# EAGLE design *StepperDriver (EAGLE 7.2.0)
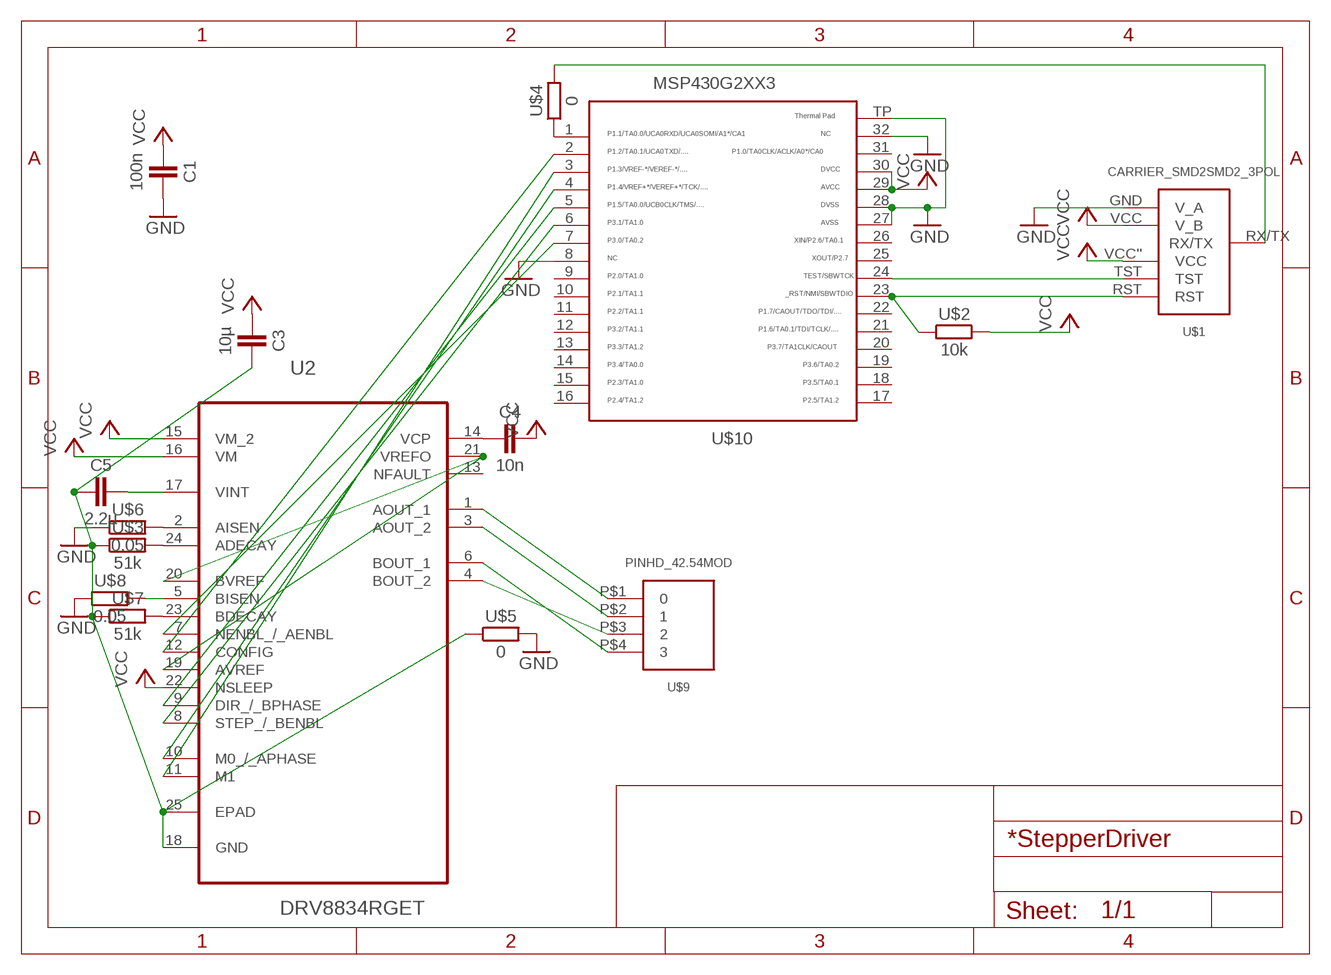
[diagram p0: schematic, sheet 1]

## Parts
C1  100n  CAPACITOR  [603]
C3  10µ  CAPACITOR  [603]
C4  10n  CAPACITOR  [603]
C5  2.2µ  CAPACITOR  [603]
U2  DRV8834RGET  [QFN50P400X400X100-25N]
U$1  CARRIER_SMD2SMD2_3POL  [CARRIER_SMD2_3POL]
U$2  10k  RESISTOR0603  [603]
U$3  51k  RESISTOR0603  [603]
U$4  0  RESISTOR0603  [603]
U$5  0  RESISTOR0603  [603]
U$6  0.05  RESISTOR0603  [603]
U$7  51k  RESISTOR0603  [603]
U$8  0.05  RESISTOR0603  [603]
U$9  PINHD_42.54MOD  [PINHD_4_MOD]
U$10  MSP430G2553  [QFN32]

## Nets
GND: C1.2 U$1.GND(V_A) U$5.2 U$6.1 U$8.1 U$10.8 U$10.27 U$10.28 U$10.32 U$10.TP
N$2: C5.2 U2.17(VINT)
N$3: U$1.TST U$10.24
N$4: U$1.RST U$2.1 U$10.23
N$5: C4.1 U2.14(VCP)
N$6: U2.24(ADECAY) U$3.2
N$7: U2.23(BDECAY) U$7.2
N$11: U$4.1 U$10.1
N$12: U$1.RX/TX U$4.2
N$13: U2.2(AISEN) U$6.2
N$14: U2.5(BISEN) U$8.2
N$16: U2.6(BOUT_1) U$9.P$4
N$18: U2.4(BOUT_2) U$9.P$3
N$21: C3.2 C5.1 U2.18(GND) U2.25(EPAD) U$3.1 U$5.1 U$7.1
N$23: U2.1(AOUT_1) U$9.P$1
N$24: U2.3(AOUT_2) U$9.P$2
N$27: U2.19(AVREF) U2.20(BVREF) U2.21(VREFO)
N$29: U2.10(M0_/_APHASE) U$10.4
N$32: U2.11(M1) U$10.3
N$34: U2.7(NENBL_/_AENBL) U$10.7
N$35: U2.8(STEP_/_BENBL) U$10.6
N$36: U2.12(CONFIG) U$10.2
N$37: U2.9(DIR_/_BPHASE) U$10.5
VCC: C1.1 C3.1 C4.2 U2.15(VM_2) U2.16(VM) U2.22(NSLEEP) U$1.VCC''(VCC) U$1.VCC(V_B) U$2.2 U$10.29 U$10.30
Unconnected: U2.13(NFAULT) U$10.9 U$10.10 U$10.11 U$10.12 U$10.13 U$10.14 U$10.15 U$10.16 U$10.17 U$10.18 U$10.19 U$10.20 U$10.21 U$10.22 U$10.25 U$10.26 U$10.31

## Library data of the parts
C1 C3-C5 = thar:CAPACITOR
U2 = DRV8834_QFN:DRV8834RGET: DUAL BRIDGE STEPPER OR DC MOTOR DRIVER,QFN-24; MPN: DRV8834RGET; OC_FARNELL: 2144264; OC_NEWARK: 27W5089; PACKAGE: QFN-24; SUPPLIER: TEXAS INSTRUMENTS
U$1 = thar:CARRIER_SMD2
U$2-U$8 = thar:RESISTOR
U$9 = thar:PINHD_4
U$10 = thar:MSP430G2553: TEXAS INSTRUMENTS MSP430G2553IRHB32R MCU, 16BIT, MSP430, 16MHZ, QFN-32 Farnell Best.Nr.: 2325726 Herst.Bez.: MSP430G2553IRHB32R

## Board
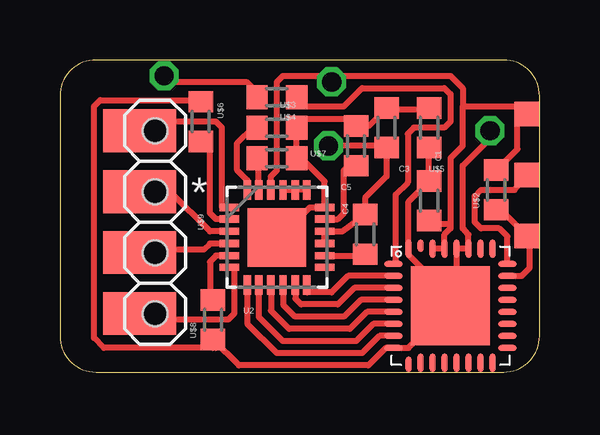
[diagram p1: board, top side]
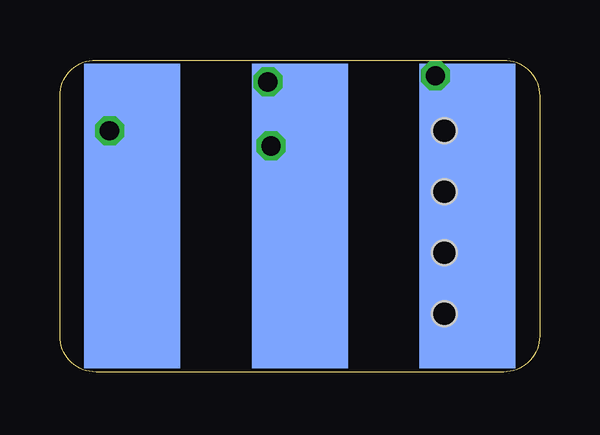
[diagram p2: board, bottom side, seen from below]

Size 20 x 13 mm. Coordinates in mm from the lower left corner, seen from the top.
Copper layers (1*16): Top 0.035mm / dielectric 1.5mm / Bottom 0.035mm
Design rules "Bilex DRU *": minimum track width 10mil, minimum drill 24mil, track to track 10mil, track to pad 10mil, pad to pad 10mil, via to via 10mil, smd to smd 10mil, copper to edge 1mil, drill to drill 8mil, minimum pad ring 10mil, minimum via ring 8mil, stop-mask expansion 4mil, vias tented up to drill 0mil, thermal gap 10mil

### Footprints (pad centres in the part's own frame; a part is rotated, then mirrored left to right if it is on the bottom)
603 = smd 0.889 x 1.016: 1 -0.826,0; 2 0.826,0
QFN50P400X400X100-25N = smd 0.813 x 0.305: 1 -1.981,1.245; 2 -1.981,0.762; 3 -1.981,0.254; 4 -1.981,-0.254; 5 -1.981,-0.762; 6 -1.981,-1.245; 13 1.981,-1.245; 14 1.981,-0.762; 15 1.981,-0.254; 16 1.981,0.254; 17 1.981,0.762; 18 1.981,1.245 | smd 0.305 x 0.813: 7 -1.245,-1.981; 8 -0.762,-1.981; 9 -0.254,-1.981; 10 0.254,-1.981; 11 0.762,-1.981; 12 1.245,-1.981; 19 1.245,1.981; 20 0.762,1.981; 21 0.254,1.981; 22 -0.254,1.981; 23 -0.762,1.981; 24 -1.245,1.981 | smd 2.438 x 2.438: 25 0,0
CARRIER_SMD2_3POL = smd 4 x 12.7 bottom: GND -6.985,0; RX/TX 6.985,0; VCC 0,0 | smd 1.016 x 1.016: RST -9.461,0.826; TST -9.461,-1.714; VCC'' -9.461,-4.255
PINHD_4_MOD = smd 1.778 x 3.048: P$1 -3.81,-0.635; P$2 -1.27,-0.635; P$3 1.27,-0.635; P$4 3.81,-0.635 | hole 1.016: -3.81,0; -1.27,0; 1.27,0; 3.81,0
QFN32 = smd 0.762 x 0.254: 1 -2.375,1.75; 2 -2.375,1.25; 3 -2.375,0.75; 4 -2.375,0.25; 5 -2.375,-0.25; 6 -2.375,-0.75; 7 -2.375,-1.25; 8 -2.375,-1.75; 17 2.375,-1.75; 18 2.375,-1.25; 19 2.375,-0.75; 20 2.375,-0.25; 21 2.375,0.25; 22 2.375,0.75; 23 2.375,1.25; 24 2.375,1.75 | smd 0.254 x 0.635: 9 -1.75,-2.438 | smd 0.254 x 0.762: 10 -1.25,-2.375; 11 -0.75,-2.375; 12 -0.25,-2.375; 13 0.25,-2.375; 14 0.75,-2.375; 15 1.25,-2.375; 16 1.75,-2.375; 25 1.75,2.375; 26 1.25,2.375; 27 0.75,2.375; 28 0.25,2.375; 29 -0.25,2.375; 30 -0.75,2.375; 32 -1.75,2.375 | smd 0.254 x 0.508: 31 -1.25,2.5 | smd 3.302 x 3.302: TP 0,0

### Placement (x,y rotation side)
C1  15.39,7.13 90 top
C3  13.62,10.18 90 top
C4  12.73,5.74 90 top
C5  12.35,9.42 270 top
U2  9.05,5.61 0 top
U$1  10,6.5 180 top
U$2  18.19,7.59 90 top
U$3  9.04,10.18 180 top
U$4  9.04,11.45 180 top
U$5  15.39,10.18 270 top
U$6  5.87,10.43 270 top
U$7  9.04,8.91 180 top
U$8  6.38,2.18 90 top
U$9  3.96,6.24 270 top
U$10  16.28,2.76 0 top

### Tracks (layer width: path | path; a pad name or v marks a point on that pad's centre or on a via)
GND  (via drill 0.8)
  Top 0.254: 16.3,3.2 16.06,4.23 16.04,4.21 | 16.3,3.2 16.35,1.92 U$10.TP 14.89,1.8 15.39,1.87 14.53,1.01 U$10.8 13.59,1.01 12.86,0.27 7.46,0.27 U$8.1 | 16.53,3.45 U$10.28 U$10.27 17.03,5.72 16.79,5.99 16.79,8.6 17.96,9.77 17.84,9.96 v17.93,10.05 17.93,9.8 | 16.53,3.45 16.03,3.28 16.3,3.2 | 16.53,3.45 15.39,4.21 15.14,4.28 14.53,4.89 U$10.32 14.53,7.1 C1.2 | 6.19,11.32 U$6.1 | 5.87,11.58 5.93,11.32 U$6.1 | 6.06,1.67 U$8.1 | 6.38,1.01 6.51,1.01 6.51,1.48 U$8.1 | 6.38,1.01 1.83,1.01 1.42,1.42 1.42,11.07 1.68,11.32 5.43,11.32 U$6.1 | 6.38,1.54 6.38,1.01 | C1.2 15.59,7.96 15.39,7.89 C1.2 | C1.2 U$5.2 | C1.2 15.08,7.96
  Bottom 0.254: v17.93,10.05 17.3,6.56 17.36,6.5 | 18,6.5 18,10.5 v17.93,10.05 | U$1.GND 16.98,9.1 v17.93,10.05
N$2
  Top 0.254: C5.2 11.9,8.47 11.84,8.4 11.84,6.62 11.59,6.37 U2.17
N$3
  Top 0.254: 19.61,7.88 19.46,8.02 19.5,8.18 | 19.5,8.18 18.95,7.59 17.55,7.59 17.3,7.33 17.3,6.24 17.55,5.99 18.32,5.99 18.66,5.65 U$10.24 | 19.5,8.18 U$1.TST
N$4
  Top 0.254: U$10.23 19.26,4.01 19.59,4.34 19.59,5.54 U$1.RST 18.38,6.76 U$2.1
N$5
  Top 0.254: U2.14 12.47,4.85 12.73,5.1 C4.1
N$6
  Top 0.254: U$3.2 8.03,10.18 7.39,9.54 7.39,8.4 7.81,7.99 U2.24
N$7
  Top 0.254: 8.16,8.98 U$7.2 8.29,8.97 U2.23
N$11
  Top 0.254: U$4.1 9.87,11.26 10.06,11.07 11.84,11.07 12.6,11.83 16.03,11.83 16.28,11.58 16.28,10.43 16.03,10.18 14.76,10.18 14.51,9.93 14.51,7.89 14,7.39 14,4.6 U$10.1
N$12  (via drill 0.8)
  Top 0.254: v4.35,12.34 4.35,12.09 7.78,12.09 8.22,11.64 U$4.2
  Bottom 0.254: U$1.RX/TX 3.01,11.01 v4.35,12.34
N$13
  Top 0.254: 6.26,9.61 U$6.2 6.25,9.48 6.25,6.62 6.51,6.37 U2.2
N$14
  Top 0.254: U$8.2 6.25,3.13 6.25,4.59 6.51,4.85 U2.5
N$16
  Top 0.254: 4.47,2.18 7.02,2.18 7.27,2.43 7.27,4.36 U2.6 | 3.84,2.18 4.47,2.18 | 4.47,2.18 4.09,2.69 3.46,2.69 U$9.P$4
N$18
  Top 0.254: U2.4 6.25,5.35 6,5.1 3.71,5.1 U$9.P$3
N$21
  Top 0.254: U2.25 9.69,6.12 9.81,6.24 10.42,6.85 U2.18 11.03,7.94 10.06,8.91 U$7.1 U$3.1 9.93,9.99 9.93,10.31 9.87,10.24 9.87,10.5 9.93,10.56 12.03,10.56 C5.1 12.86,10.24 C3.2 13.74,10.94 15.2,10.94 U$5.1
N$23
  Top 0.254: U2.1 6.91,6.85 6.76,6.88 6.76,10.18 6.51,10.43 3.58,10.43 U$9.P$1
N$24
  Top 0.254: U$9.P$2 3.58,7.64 4.6,7.77 4.6,7.51 6.25,5.86 U2.3
N$27
  Top 0.254: U2.19 U2.20 U2.21
N$29
  Top 0.254: U2.10 9.3,2.81 9.81,2.31 11.84,2.31 12.54,3.01 U$10.4
N$32
  Top 0.254: U2.11 9.81,3.06 10.06,2.81 11.59,2.81 12.28,3.51 U$10.3
N$34
  Top 0.254: U2.7 7.81,2.02 9.04,0.78 12.6,0.78 13.33,1.51 U$10.7
N$35
  Top 0.254: U2.8 8.29,2.3 9.3,1.29 12.35,1.29 13.07,2.01 U$10.6
N$36
  Top 0.254: U$10.2 12.02,4.01 11.33,3.32 10.31,3.32 10.3,3.34 U2.12
N$37
  Top 0.254: U2.9 8.8,2.55 9.55,1.8 12.09,1.8 12.8,2.51 U$10.5
VCC  (via drill 0.8)
  Top 0.254: U$10.30 U$10.29 16.03,5.74 16.28,5.99 16.28,6.24 | 19.5,10.52 19.46,10.56 | 19.2,10.56 19.2,10.51 19.46,10.56 | 19.65,11.01 19.65,10.75 19.46,10.56 | 15.53,6.31 C1.1 15.52,6.24 15.53,6.24 15.53,6.18 16.22,6.18 16.28,6.24 | 19.08,10.69 19.46,10.88 U$1.VCC'' | 19.08,10.69 19.65,11.01 | 18.19,8.66 18.07,8.54 U$2.2 18.31,8.54 | U$1.VCC'' 19.4,10.81 19.2,10.69 19.46,10.94 19.59,10.94 19.65,11.01 | 18.31,8.54 18.32,8.53 | 18.31,8.54 18.19,8.66 | 19.08,10.69 19.08,11.07 16.79,11.07 | 16.79,11.07 16.79,9.42 16.28,8.91 16.28,6.24 | 18.19,8.66 18.44,8.66 19.08,9.29 19.08,10.37 U$1.VCC'' | v11.33,12.09 11.33,12.34 | 11.33,12.34 9.3,12.34 9.04,12.09 9.04,8.4 8.8,8.15 U2.22 | 11.33,12.34 16.28,12.34 16.79,11.83 16.79,11.07 | C4.2 12.54,6.62 12.73,6.62 | U2.15 U2.16 11.78,5.86 C4.2 | 11.08,9.42 v11.2,9.42 11.33,9.42 13.49,9.42 C3.1 13.62,8.15 12.73,7.26 C4.2
  Bottom 0.254: v11.33,12.09 10,10.88 U$1.VCC 10,8.09 v11.2,9.42